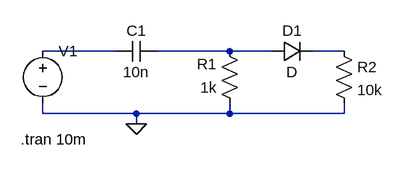
[diagram p0: schematic highpassfilter_pos_edge.asc]
highpassfilter_pos_edge.asc, the LTspice schematic file:
Version 4
SHEET 1 880 680
WIRE 32 112 -80 112
WIRE 208 112 96 112
WIRE 272 112 208 112
WIRE 384 112 336 112
WIRE -80 208 -80 192
WIRE 64 208 -80 208
WIRE 208 208 208 192
WIRE 208 208 64 208
WIRE 384 208 384 192
WIRE 384 208 208 208
WIRE 64 224 64 208
FLAG 64 224 0
SYMBOL voltage -80 96 R0
WINDOW 3 24 96 Invisible 2
WINDOW 123 0 0 Left 2
WINDOW 39 0 0 Left 2
SYMATTR InstName V1
SYMATTR Value PULSE(0 5 1n 1n 1n 0.5m 1m)
SYMBOL res 224 208 R180
WINDOW 0 36 76 Left 2
WINDOW 3 36 40 Left 2
SYMATTR InstName R1
SYMATTR Value 1k
SYMBOL cap 96 96 R90
WINDOW 0 0 32 VBottom 2
WINDOW 3 32 32 VTop 2
SYMATTR InstName C1
SYMATTR Value 10n
SYMBOL diode 272 128 R270
WINDOW 0 32 32 VTop 2
WINDOW 3 0 32 VBottom 2
SYMATTR InstName D1
SYMBOL res 368 96 R0
SYMATTR InstName R2
SYMATTR Value 10k
TEXT -114 248 Left 2 !.tran 10m

The netlist it stands for:
* highpassfilter_pos_edge.asc
V1 N001 0 PULSE(0 5 1n 1n 1n 0.5m 1m)
R1 0 N002 1k
C1 N002 N001 10n
D1 N002 N003 D
R2 N003 0 10k
.model D D
.lib standard.dio
.tran 10m
.backanno
.end